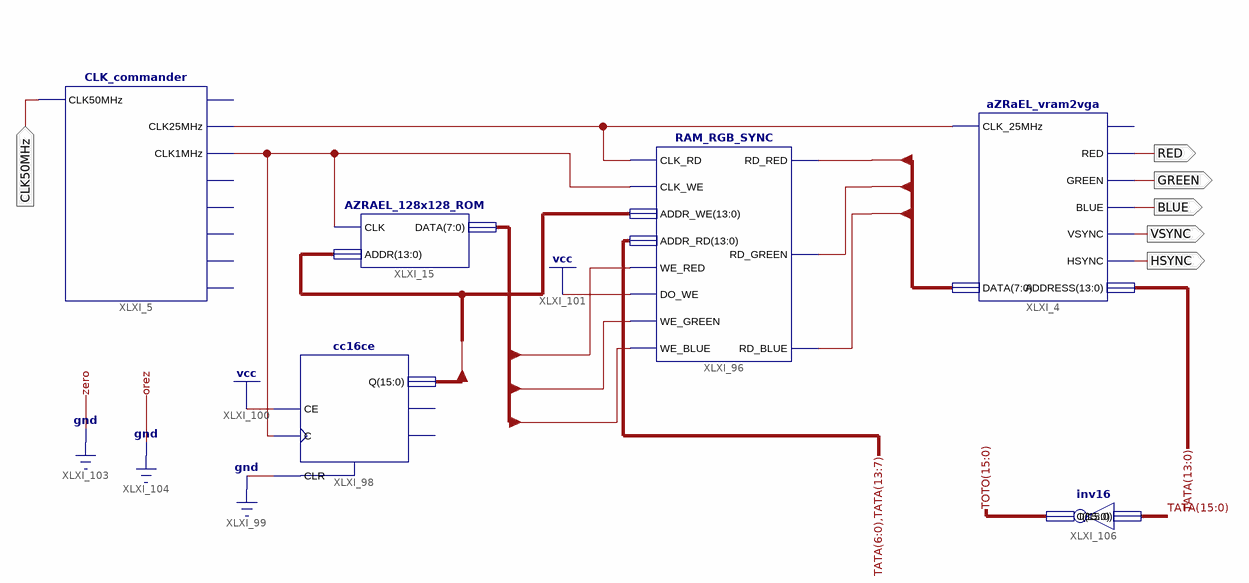
[diagram p0: schematic sheet 1]
// Xilinx ISE schematic aZRaEL_RAM_test.sch (spartan3) as structural Verilog: 6 symbols, 6 ports
module aZRaEL_RAM_test (
  input  CLK50MHz,
  output RED,
  output GREEN,
  output BLUE,
  output VSYNC,
  output HSYNC
);

  wire XLXN_241, XLXN_266;
  wire [7:0] RGB, RGBxxXXX;
  wire [15:0] ADDR_WE, TATA, TOTO;

  CLK_commander XLXI_5 (
    .CLK50MHz(CLK50MHz), .CLK25MHz(XLXN_241), .CLK1MHz(XLXN_266));  // open: CLK100MHz, PREPARE_WRITE, DO_WRITE, PREPARE_READ, DO_READ, CLK4MHz
  RAM_RGB_SYNC XLXI_96 (
    .CLK_RD(XLXN_241), .CLK_WE(XLXN_266), .ADDR_WE(ADDR_WE[13:0]), .ADDR_RD({TATA[6:0], TATA[13:7]}),
    .WE_RED(RGBxxXXX[7]), .DO_WE(1'b1), .WE_GREEN(RGBxxXXX[6]), .WE_BLUE(RGBxxXXX[5]), .RD_RED(RGB[7]),
    .RD_GREEN(RGB[6]), .RD_BLUE(RGB[5]));
  cc16ce XLXI_98 (.C(XLXN_266), .CE(1'b1), .CLR(1'b0), .Q(ADDR_WE));  // open: CEO, TC
  AZRAEL_128x128_ROM XLXI_15 (.CLK(XLXN_266), .ADDR(ADDR_WE[13:0]), .DATA(RGBxxXXX));
  aZRaEL_vram2vga XLXI_4 (
    .CLK_25MHz(XLXN_241), .DATA(RGB), .RED(RED), .GREEN(GREEN), .BLUE(BLUE), .VSYNC(VSYNC), .HSYNC(HSYNC),
    .ADDRESS(TATA[13:0]));  // open: R
  inv16 XLXI_106 (.I(TATA), .O(TOTO));
endmodule
